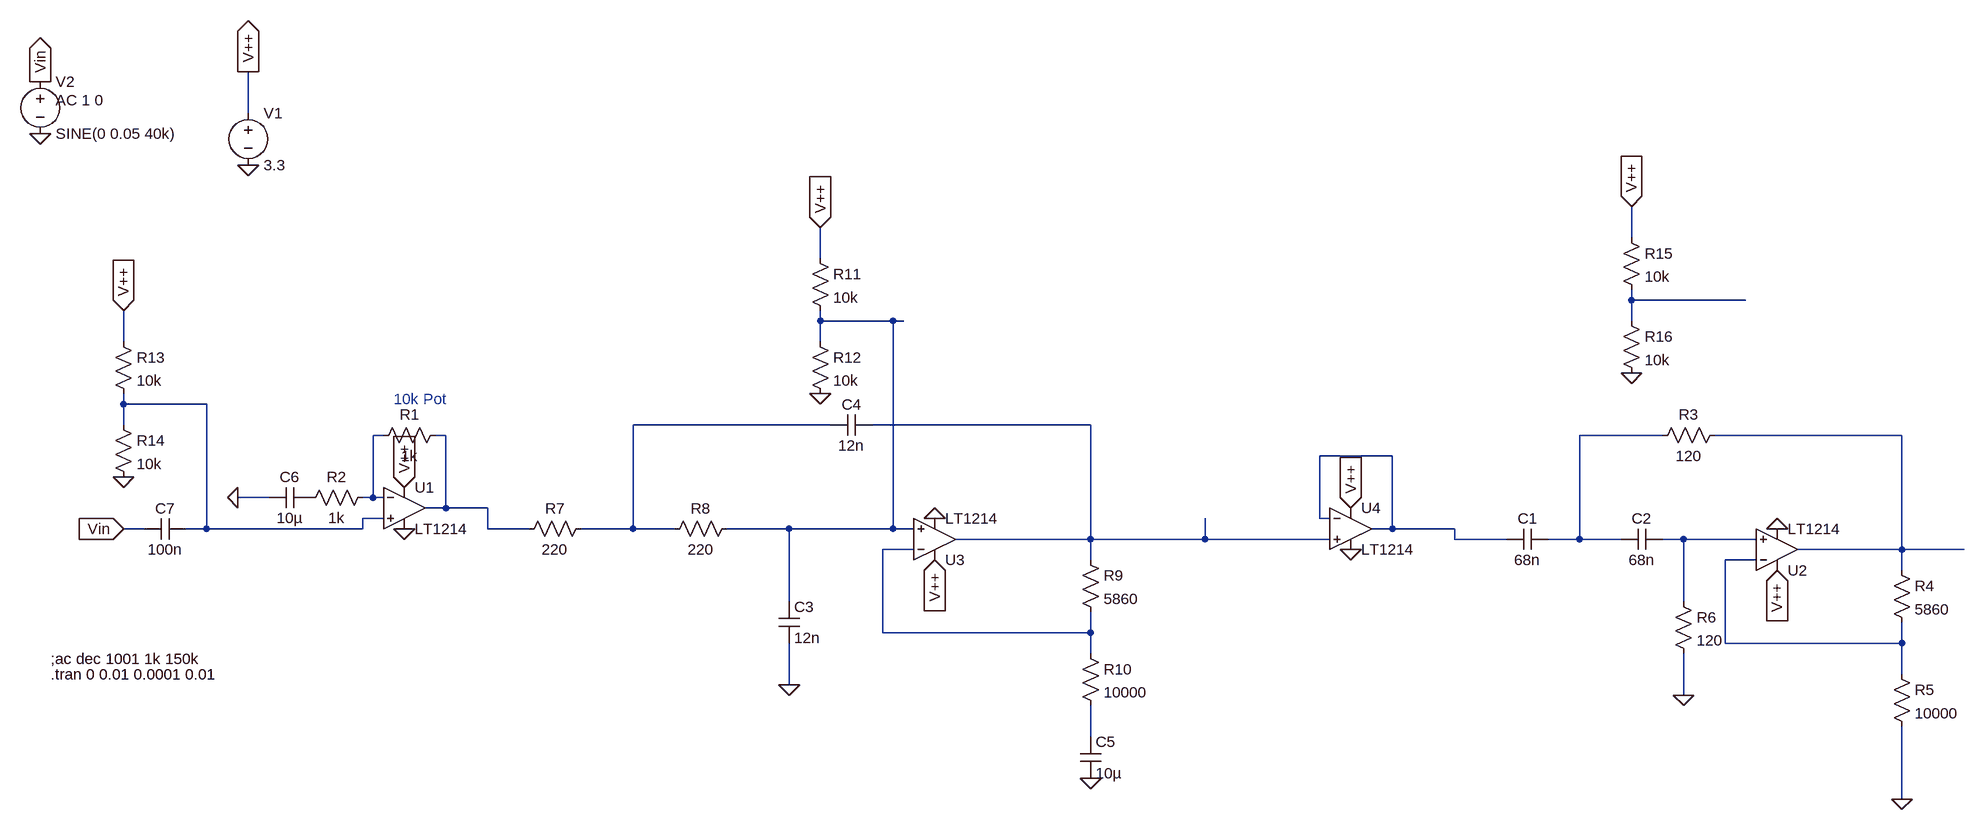
[diagram p0: schematic RxNew2.asc]
RxNew2.asc, the LTspice schematic file:
Version 4
SHEET 1 2132 680
WIRE -512 -640 -512 -704
WIRE 1616 -448 1616 -496
WIRE 368 -416 368 -464
WIRE 1616 -352 1616 -368
WIRE 1792 -352 1616 -352
WIRE 368 -320 368 -336
WIRE 480 -320 368 -320
WIRE 496 -320 480 -320
WIRE 1616 -320 1616 -352
WIRE -704 -288 -704 -336
WIRE 368 -288 368 -320
WIRE -704 -192 -704 -208
WIRE -576 -192 -704 -192
WIRE -704 -160 -704 -192
WIRE 384 -160 80 -160
WIRE 784 -160 448 -160
WIRE -304 -144 -320 -144
WIRE -208 -144 -224 -144
WIRE 1664 -144 1536 -144
WIRE 2032 -144 1744 -144
WIRE 1248 -112 1136 -112
WIRE -480 -48 -528 -48
WIRE -320 -48 -320 -144
WIRE -320 -48 -336 -48
WIRE -304 -48 -320 -48
WIRE -208 -32 -208 -144
WIRE -208 -32 -240 -32
WIRE -144 -32 -208 -32
WIRE -304 -16 -336 -16
WIRE 1136 -16 1136 -112
WIRE 1152 -16 1136 -16
WIRE -672 0 -704 0
WIRE -576 0 -576 -192
WIRE -576 0 -608 0
WIRE -336 0 -336 -16
WIRE -336 0 -576 0
WIRE -144 0 -144 -32
WIRE -80 0 -144 0
WIRE 80 0 80 -160
WIRE 80 0 0 0
WIRE 144 0 80 0
WIRE 320 0 224 0
WIRE 480 0 480 -320
WIRE 480 0 320 0
WIRE 512 0 480 0
WIRE 1248 0 1248 -112
WIRE 1248 0 1216 0
WIRE 1344 0 1248 0
WIRE 784 16 784 -160
WIRE 784 16 576 16
WIRE 960 16 960 -16
WIRE 960 16 784 16
WIRE 1152 16 960 16
WIRE 1344 16 1344 0
WIRE 1424 16 1344 16
WIRE 1536 16 1536 -144
WIRE 1536 16 1488 16
WIRE 1600 16 1536 16
WIRE 1696 16 1664 16
WIRE 1808 16 1696 16
WIRE 512 32 464 32
WIRE 2032 32 2032 -144
WIRE 2032 32 1872 32
WIRE 2128 32 2032 32
WIRE 784 48 784 16
WIRE 1808 48 1760 48
WIRE 2032 64 2032 32
WIRE 320 112 320 0
WIRE 1696 112 1696 16
WIRE 464 160 464 32
WIRE 784 160 784 128
WIRE 784 160 464 160
WIRE 1760 176 1760 48
WIRE 2032 176 2032 144
WIRE 2032 176 1760 176
WIRE 784 192 784 160
WIRE 2032 224 2032 176
WIRE 320 240 320 176
WIRE 1696 256 1696 192
WIRE 784 320 784 272
WIRE 2032 416 2032 304
FLAG -528 -48 0
FLAG -272 -64 V++
IOPIN -272 -64 In
FLAG 1696 256 0
FLAG 320 240 0
FLAG 1184 -32 V++
IOPIN 1184 -32 In
FLAG -704 0 Vin
IOPIN -704 0 In
FLAG -512 -560 0
FLAG -512 -704 V++
IOPIN -512 -704 Out
FLAG -832 -608 0
FLAG -832 -688 Vin
IOPIN -832 -688 Out
FLAG -704 -336 V++
IOPIN -704 -336 In
FLAG -704 -80 0
FLAG -272 0 0
FLAG 1184 32 0
FLAG 1616 -496 V++
IOPIN 1616 -496 In
FLAG 1616 -240 0
FLAG 784 384 0
FLAG 544 48 V++
IOPIN 544 48 In
FLAG 1840 64 V++
IOPIN 1840 64 In
FLAG 544 -16 0
FLAG 1840 0 0
FLAG 2032 416 0
FLAG 368 -464 V++
IOPIN 368 -464 In
FLAG 368 -208 0
SYMBOL Opamps\\LT1214 -272 -96 R0
SYMATTR InstName U1
SYMBOL res -208 -160 R90
WINDOW 0 0 56 VBottom 2
WINDOW 3 32 56 VTop 2
SYMATTR InstName R1
SYMATTR Value 1k
SYMBOL res -320 -64 R90
WINDOW 0 0 56 VBottom 2
WINDOW 3 32 56 VTop 2
SYMATTR InstName R2
SYMATTR Value 1k
SYMBOL cap 1488 0 R90
WINDOW 0 0 32 VBottom 2
WINDOW 3 32 32 VTop 2
SYMATTR InstName C1
SYMATTR Value 68n
SYMBOL cap 1664 0 R90
WINDOW 0 0 32 VBottom 2
WINDOW 3 32 32 VTop 2
SYMATTR InstName C2
SYMATTR Value 68n
SYMBOL Opamps\\LT1214 1840 96 M180
SYMATTR InstName U2
SYMBOL res 1760 -160 R90
WINDOW 0 0 56 VBottom 2
WINDOW 3 32 56 VTop 2
SYMATTR InstName R3
SYMATTR Value 120
SYMBOL res 2016 48 R0
SYMATTR InstName R4
SYMATTR Value 5860
SYMBOL res 2016 208 R0
SYMATTR InstName R5
SYMATTR Value 10000
SYMBOL res 1680 96 R0
SYMATTR InstName R6
SYMATTR Value 120
SYMBOL res 16 -16 R90
WINDOW 0 0 56 VBottom 2
WINDOW 3 32 56 VTop 2
SYMATTR InstName R7
SYMATTR Value 220
SYMBOL res 240 -16 R90
WINDOW 0 0 56 VBottom 2
WINDOW 3 32 56 VTop 2
SYMATTR InstName R8
SYMATTR Value 220
SYMBOL cap 304 112 R0
SYMATTR InstName C3
SYMATTR Value 12n
SYMBOL cap 448 -176 R90
WINDOW 0 0 32 VBottom 2
WINDOW 3 32 32 VTop 2
SYMATTR InstName C4
SYMATTR Value 12n
SYMBOL Opamps\\LT1214 544 80 M180
SYMATTR InstName U3
SYMBOL res 768 32 R0
SYMATTR InstName R9
SYMATTR Value 5860
SYMBOL res 768 176 R0
SYMATTR InstName R10
SYMATTR Value 10000
SYMBOL Opamps\\LT1214 1184 -64 R0
SYMATTR InstName U4
SYMBOL voltage -512 -656 R0
WINDOW 123 0 0 Left 0
WINDOW 39 0 0 Left 0
SYMATTR InstName V1
SYMATTR Value 3.3
SYMBOL voltage -832 -704 R0
WINDOW 123 24 44 Left 2
WINDOW 39 0 0 Left 0
SYMATTR Value2 AC 1 0
SYMATTR InstName V2
SYMATTR Value SINE(0 0.05 40k)
SYMBOL res -720 -304 R0
SYMATTR InstName R13
SYMATTR Value 10k
SYMBOL res -720 -176 R0
SYMATTR InstName R14
SYMATTR Value 10k
SYMBOL cap -416 -64 R90
WINDOW 0 0 32 VBottom 2
WINDOW 3 32 32 VTop 2
SYMATTR InstName C6
SYMATTR Value 10µ
SYMBOL cap -608 -16 R90
WINDOW 0 0 32 VBottom 2
WINDOW 3 32 32 VTop 2
SYMATTR InstName C7
SYMATTR Value 100n
SYMBOL res 1600 -464 R0
SYMATTR InstName R15
SYMATTR Value 10k
SYMBOL res 1600 -336 R0
SYMATTR InstName R16
SYMATTR Value 10k
SYMBOL res 352 -432 R0
SYMATTR InstName R11
SYMATTR Value 10k
SYMBOL res 352 -304 R0
SYMATTR InstName R12
SYMATTR Value 10k
SYMBOL cap 768 320 R0
SYMATTR InstName C5
SYMATTR Value 10µ
TEXT -816 200 Left 2 !;ac dec 1001 1k 150k
TEXT -288 -200 Left 2 ;10k Pot
TEXT -816 224 Left 2 !.tran 0 0.01 0.0001 0.01

The netlist it stands for:
* RxNew2.asc
XU1 N003 N006 V++ 0 N007 LT1213  ; LT1214, pins In+ In- V+ V- OUT
R1 N007 N006 1k
R2 N006 P001 1k
C1 N008 N010 68n
C2 N011 N008 68n
XU2 N011 N013 V++ 0 N009 LT1213  ; LT1214, pins In+ In- V+ V- OUT
R3 N009 N008 120
R4 N009 N013 5860
R5 N013 0 10000
R6 N011 0 120
R7 N004 N007 220
R8 N002 N004 220
C3 N002 0 12n
C4 N005 N004 12n
XU3 N002 N012 V++ 0 N005 LT1213  ; LT1214, pins In+ In- V+ V- OUT
R9 N005 N012 5860
R10 N012 N014 10000
XU4 N005 N010 V++ 0 N010 LT1213  ; LT1214, pins In+ In- V+ V- OUT
V1 V++ 0 3.3
V2 Vin 0 SINE(0 0.05 40k) AC 1 0
R13 V++ N003 10k
R14 N003 0 10k
C6 P001 0 10µ
C7 N003 Vin 100n
R15 V++ N001 10k
R16 N001 0 10k
R11 V++ N002 10k
R12 N002 0 10k
C5 N014 0 10µ
;ac dec 1001 1k 150k
* 10k Pot
.tran 0 0.01 0.0001 0.01
.lib LTC.lib
.backanno
.end